# EAGLE design mcp3551_adc_module (EAGLE 7.4.0)
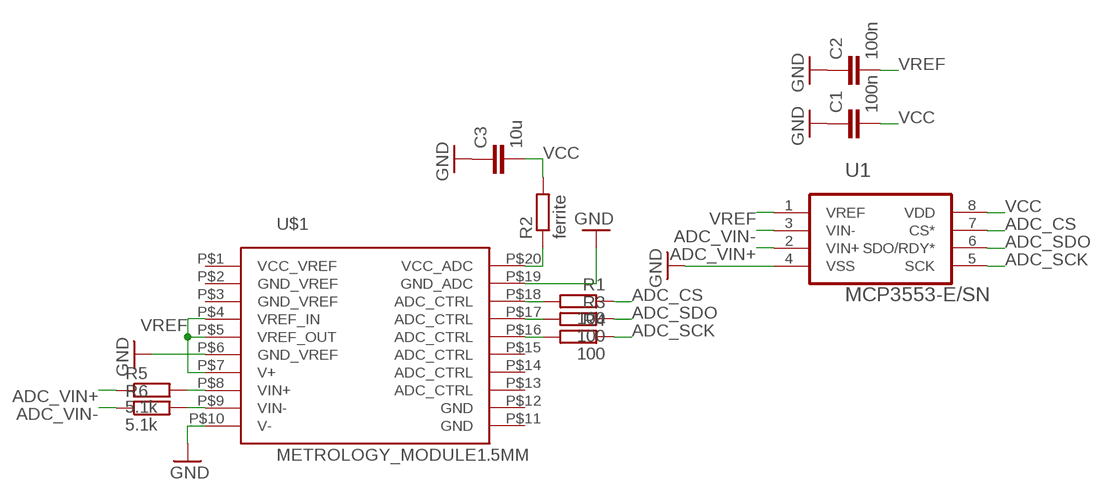
[diagram p0: schematic, sheet 1]

## Parts
C1  100n  C-EUC0603  [C0603]
C2  100n  C-EUC0603  [C0603]
C3  10u  C-EUC0805  [C0805]
R1  100  R-EU_R0603  [R0603]
R2  ferrite  R-EU_R0805  [R0805]
R3  100  R-EU_R0603  [R0603]
R4  100  R-EU_R0603  [R0603]
R5  5.1k  R-EU_R0805  [R0805]
R6  5.1k  R-EU_R0805  [R0805]
U1  MCP3553-E/SN  [SOIC127P600X175-8N]
U$1  METROLOGY_MODULE1.5MM  [METROLOGY_MODULE_1.5MM_HOLE]

## Nets
ADC_CS: R1.1 U1.7(CS*)
ADC_SCK: R4.1 U1.5(SCK)
ADC_SDO: R3.1 U1.6(SDO/RDY*)
ADC_VIN+: R5.1 U1.2(VIN+)
ADC_VIN-: R6.1 U1.3(VIN-)
GND: C1.1 C2.1 C3.1 U1.4(VSS) U$1.P$6(GND_VREF) U$1.P$10(V-) U$1.P$19(GND_ADC)
N$1: R2.1 U$1.P$20(VCC_ADC)
N$2: R1.2 U$1.P$18(ADC_CTRL)
N$3: R3.2 U$1.P$17(ADC_CTRL)
N$4: R4.2 U$1.P$16(ADC_CTRL)
N$5: R5.2 U$1.P$8(VIN+)
N$6: R6.2 U$1.P$9(VIN-)
VCC: C1.2 C3.2 R2.2 U1.8(VDD)
VREF: C2.2 U1.1(VREF) U$1.P$4(VREF_IN) U$1.P$5(VREF_OUT) U$1.P$7(V+)
Unconnected: U$1.P$1(VCC_VREF) U$1.P$2(GND_VREF) U$1.P$3(GND_VREF) U$1.P$11(GND) U$1.P$12(GND) U$1.P$13(ADC_CTRL) U$1.P$14(ADC_CTRL) U$1.P$15(ADC_CTRL)

## Library data of the parts
C1-C3 = SquantorRCL:C-EU: CAPACITOR, European symbol
R1-R6 = SquantorRCL:R-EU_: RESISTOR, European symbol
U1 = SquantorMicrochip:MCP3553-E/SN: IC ADC 22BIT 2.7V 1CH SPI ,SOIC-8; MPN: MCP3553-E/SN; OC_FARNELL: 1605569; OC_NEWARK: 56K7004; PACKAGE: SOIC-8; SUPPLIER: Microchip
U$1 = SquantorPCBOutline:METROLOGY_MODULE

## Board
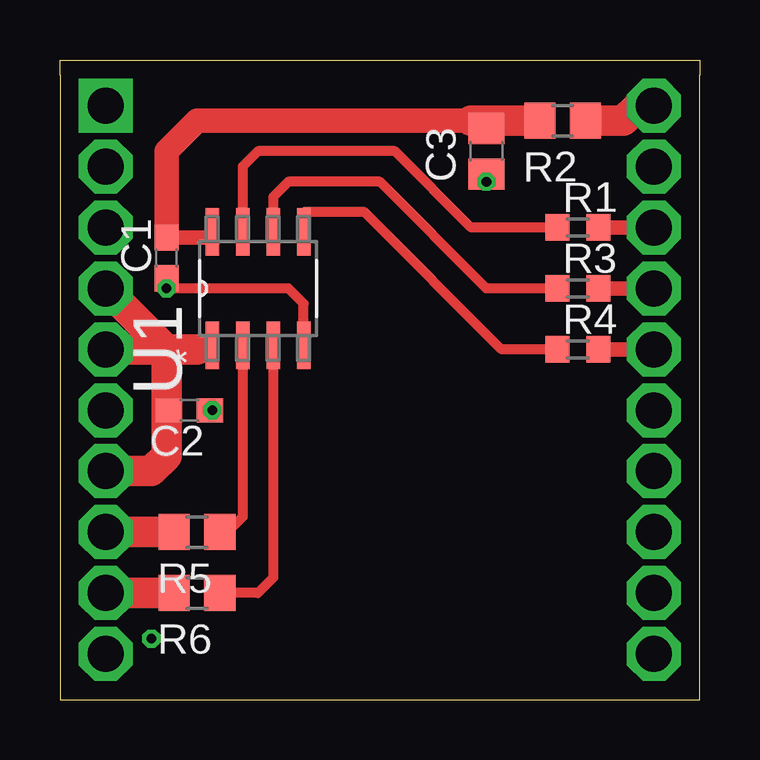
[diagram p1: board, top side]
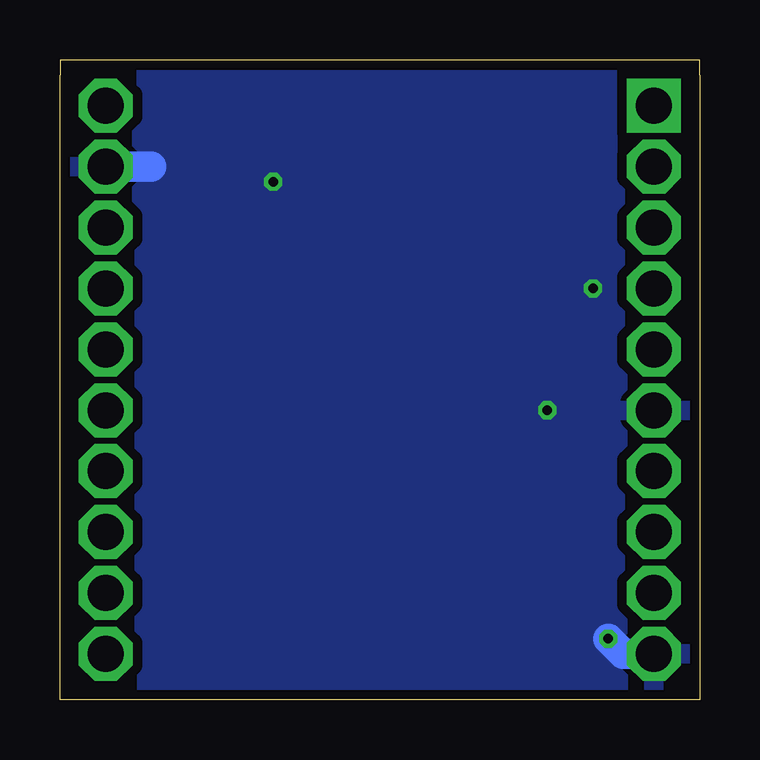
[diagram p2: board, bottom side, seen from below]

Size 26.67 x 26.67 mm. Coordinates in mm from the lower left corner, seen from the top.
Outline: 0,26.04 0,26.67 26.67,26.67 26.67,26.04
Copper layers (1*16): Top 0.0356mm / dielectric 1.5011mm / Bottom 0.0356mm
Design rules "OSHPark": minimum track width 6mil, minimum drill 13mil, track to track 6mil, track to pad 6mil, pad to pad 6mil, via to via 6mil, smd to smd 6mil, copper to edge 15mil, drill to drill 6mil, minimum pad ring 7mil, minimum via ring 7mil, stop-mask expansion 3mil, vias tented up to drill 0mil, thermal gap 10mil

### Footprints (pad centres in the part's own frame; a part is rotated, then mirrored left to right if it is on the bottom)
C0603 = smd 1.1 x 1: 1 -0.85,0; 2 0.85,0
C0805 = smd 1.3 x 1.5: 1 -0.95,0; 2 0.95,0
R0603 = smd 1 x 1.1: 1 -0.85,0; 2 0.85,0
R0805 = smd 1.3 x 1.5: 1 -0.95,0; 2 0.95,0
SOIC127P600X175-8N = smd 1.981 x 0.559: 1 -2.362,1.905; 2 -2.362,0.635; 3 -2.362,-0.635; 4 -2.362,-1.905; 5 2.362,-1.905; 6 2.362,-0.635; 7 2.362,0.635; 8 2.362,1.905
METROLOGY_MODULE_1.5MM_HOLE = drill 1.5 pad 1.8 square: P$1 -11.43,11.43 | drill 1.5 pad 1.8 octagon: P$2 -11.43,8.89; P$3 -11.43,6.35; P$4 -11.43,3.81; P$5 -11.43,1.27; P$6 -11.43,-1.27; P$7 -11.43,-3.81; P$8 -11.43,-6.35; P$9 -11.43,-8.89; P$10 -11.43,-11.43; P$11 11.43,-11.43; P$12 11.43,-8.89; P$13 11.43,-6.35; P$14 11.43,-3.81; P$15 11.43,-1.27; P$16 11.43,1.27; P$17 11.43,3.81; P$18 11.43,6.35; P$19 11.43,8.89; P$20 11.43,11.43

### Placement (x,y rotation side)
C1  4.45,18.42 90 top
C2  5.4,12.07 180 top
C3  17.78,22.86 90 top
R1  21.59,19.69 0 top
R2  20.96,24.13 180 top
R3  21.59,17.15 0 top
R4  21.59,14.61 0 top
R5  5.72,6.99 180 top
R6  5.72,4.45 180 top
U1  8.26,17.15 90 top
U$1  13.34,13.34 0 top

### Tracks (layer width: path | path; a pad name or v marks a point on that pad's centre or on a via)
ADC_CS
  Top 0.406: R1.1 17.15,19.69 13.97,22.86 8.26,22.86 7.62,22.23 U1.7
ADC_SCK
  Top 0.406: R4.1 18.42,14.61 12.7,20.32 10.16,20.32 U1.5
ADC_SDO
  Top 0.406: R3.1 17.78,17.15 13.34,21.59 9.53,21.59 8.89,20.96 U1.6
ADC_VIN+
  Top 0.406: U1.2 7.62,7.62 6.99,6.99 R5.1
ADC_VIN-
  Top 0.406: U1.3 8.89,5.08 8.26,4.45 R6.1
GND  (via drill 0.4)
  Top 0.406: U1.4 10.16,16.51 9.53,17.15 v4.45,17.15 C1.1 | C3.1 v17.78,21.59 | C2.1 v6.35,12.07
  Bottom 1.27: U$1.P$19 22.86,22.23 | U$1.P$10 3.18,1.91 v3.81,2.54
  pour Bottom (isolate 0.406): 0,26.67 26.67,26.67 26.67,0 0,0
N$1
  Top 1.27: U$1.P$20 24.13,24.77 23.5,24.13 R2.1
N$2
  Top 0.61: U$1.P$18 R1.2
N$3
  Top 0.61: U$1.P$17 R3.2
N$4
  Top 0.61: U$1.P$16 R4.2
N$5
  Top 1.27: U$1.P$8 R5.2
N$6
  Top 1.27: U$1.P$9 R6.2
VCC
  Top 0.61: C1.2 6.11,19.27 U1.8
  Top 1.016: 17.15,24.13 5.72,24.13 4.45,22.86 C1.2
  Top 1.27: R2.2 17.78,24.13 | 17.78,24.13 17.15,24.13 | C3.2 17.78,24.13
VREF
  Top 0.406: 5.72,14.61 6.17,14.61 U1.1 | C2.2 4.45,12.07
  Top 1.27: U$1.P$5 4.45,14.61 | 4.45,14.61 5.72,14.61 | U$1.P$4 4.45,14.61 | U$1.P$7 3.81,9.53 4.45,10.16 4.45,12.07 4.45,14.61